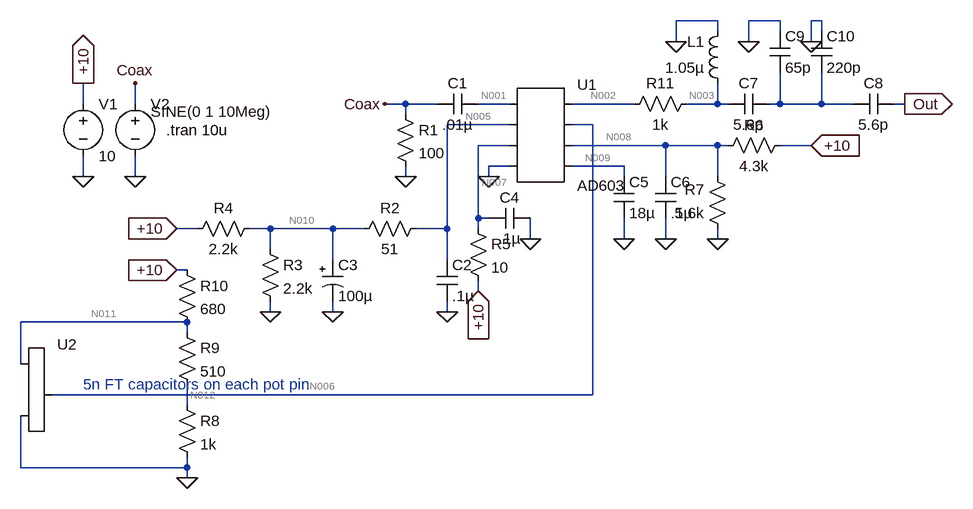
[diagram p0: schematic IF and Log Amplifier.asc]
* IF and Log Amplifier.asc
* U1: AD603 (symbol AutoGenerated\AD603 not available, pins judged from their places): pin1=N001 pin2=N005 pin3=N007 pin4=0 pin5=N002 pin6=N006 pin7=N008 pin8=N009
C1 N001 Coax .01µ
R1 Coax 0 100
R2 N005 N010 51
R3 N010 0 2.2k
R4 N010 +10 2.2k
C2 N005 0 .1µ
C3 N010 0 100µ
R5 N007 +10 10
C4 0 N007 .1µ
C5 N009 0 18µ
C6 N008 0 .1µ
R6 +10 N008 4.3k
R7 0 N008 5.6k
XU2 N011 0 N006 potentiometer_standard
R8 N012 0 1k
R9 N011 N012 510
R10 +10 N011 680
R11 N003 N002 1k
C7 N004 N003 5.6p
C8 Out N004 5.6p
L1 N003 0 1.05µ
C9 0 N004 65p
C10 0 N004 220p
V1 +10 0 10
V2 Coax 0 SINE(0 1 10Meg)
* 5n FT capacitors on each pot pin
.tran 10u
.backanno
.end

* Results of the author's LTspice run, read from the files saved beside the schematic
* Operating Point, zero values left out:
*   V(n001) = 4.983 V
*   V(n005) = 4.983 V
*   V(n007) = 9.829 V
*   V(n006) = 3.293 V
*   V(n008) = 5.656 V
*   V(n002) = 4.965 V
*   V(n009) = 4.981 V
*   V(n010) = 4.984 V
*   V(+10) = 10 V
*   V(n011) = 6.586 V
*   V(n012) = 4.362 V
*   V(n003) = 4.965 µV
*   I(L1) = 4.965 mA
*   I(R11) = -4.965 mA
*   I(R10) = 5.02 mA
*   I(R9) = 4.362 mA
*   I(R8) = 4.362 mA
*   I(R7) = -1.01 mA
*   I(R6) = 1.01 mA
*   I(R5) = -17.13 mA
*   I(R4) = -2.28 mA
*   I(R3) = 2.265 mA
*   I(R2) = -14.89 µA
*   I(V1) = -25.44 mA
*   Ix(u1:2) = 14.89 µA
*   Ix(u1:99) = 17.13 mA
*   Ix(u1:50) = -12.22 mA
*   Ix(u1:48) = -4.965 mA
*   Ix(u1:40) = 157.7 nA
*   Ix(u1:41) = 242.3 nA
*   Ix(u2:1) = 658.7 µA
*   Ix(u2:2) = -658.5 µA
*   Ix(u2:3) = -157.7 nA
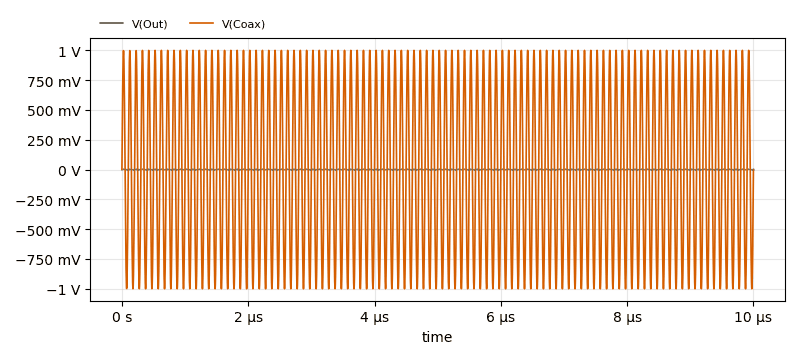
[diagram p1: Transient Analysis of IF and Log Amplifier.asc, plotted from the saved traces]
* Transient Analysis, 1 run:
*   V(Out): min -2.005 mV, max 1.945 mV, average -3.487 µV, rms 1.367 mV, last -321.9 µV
*   V(Coax): min -1 V, max 1 V, average -75.71 µV, rms 708.5 mV, last 0 V